# Altium project MCU_BMA_V1_0.PrjPcb
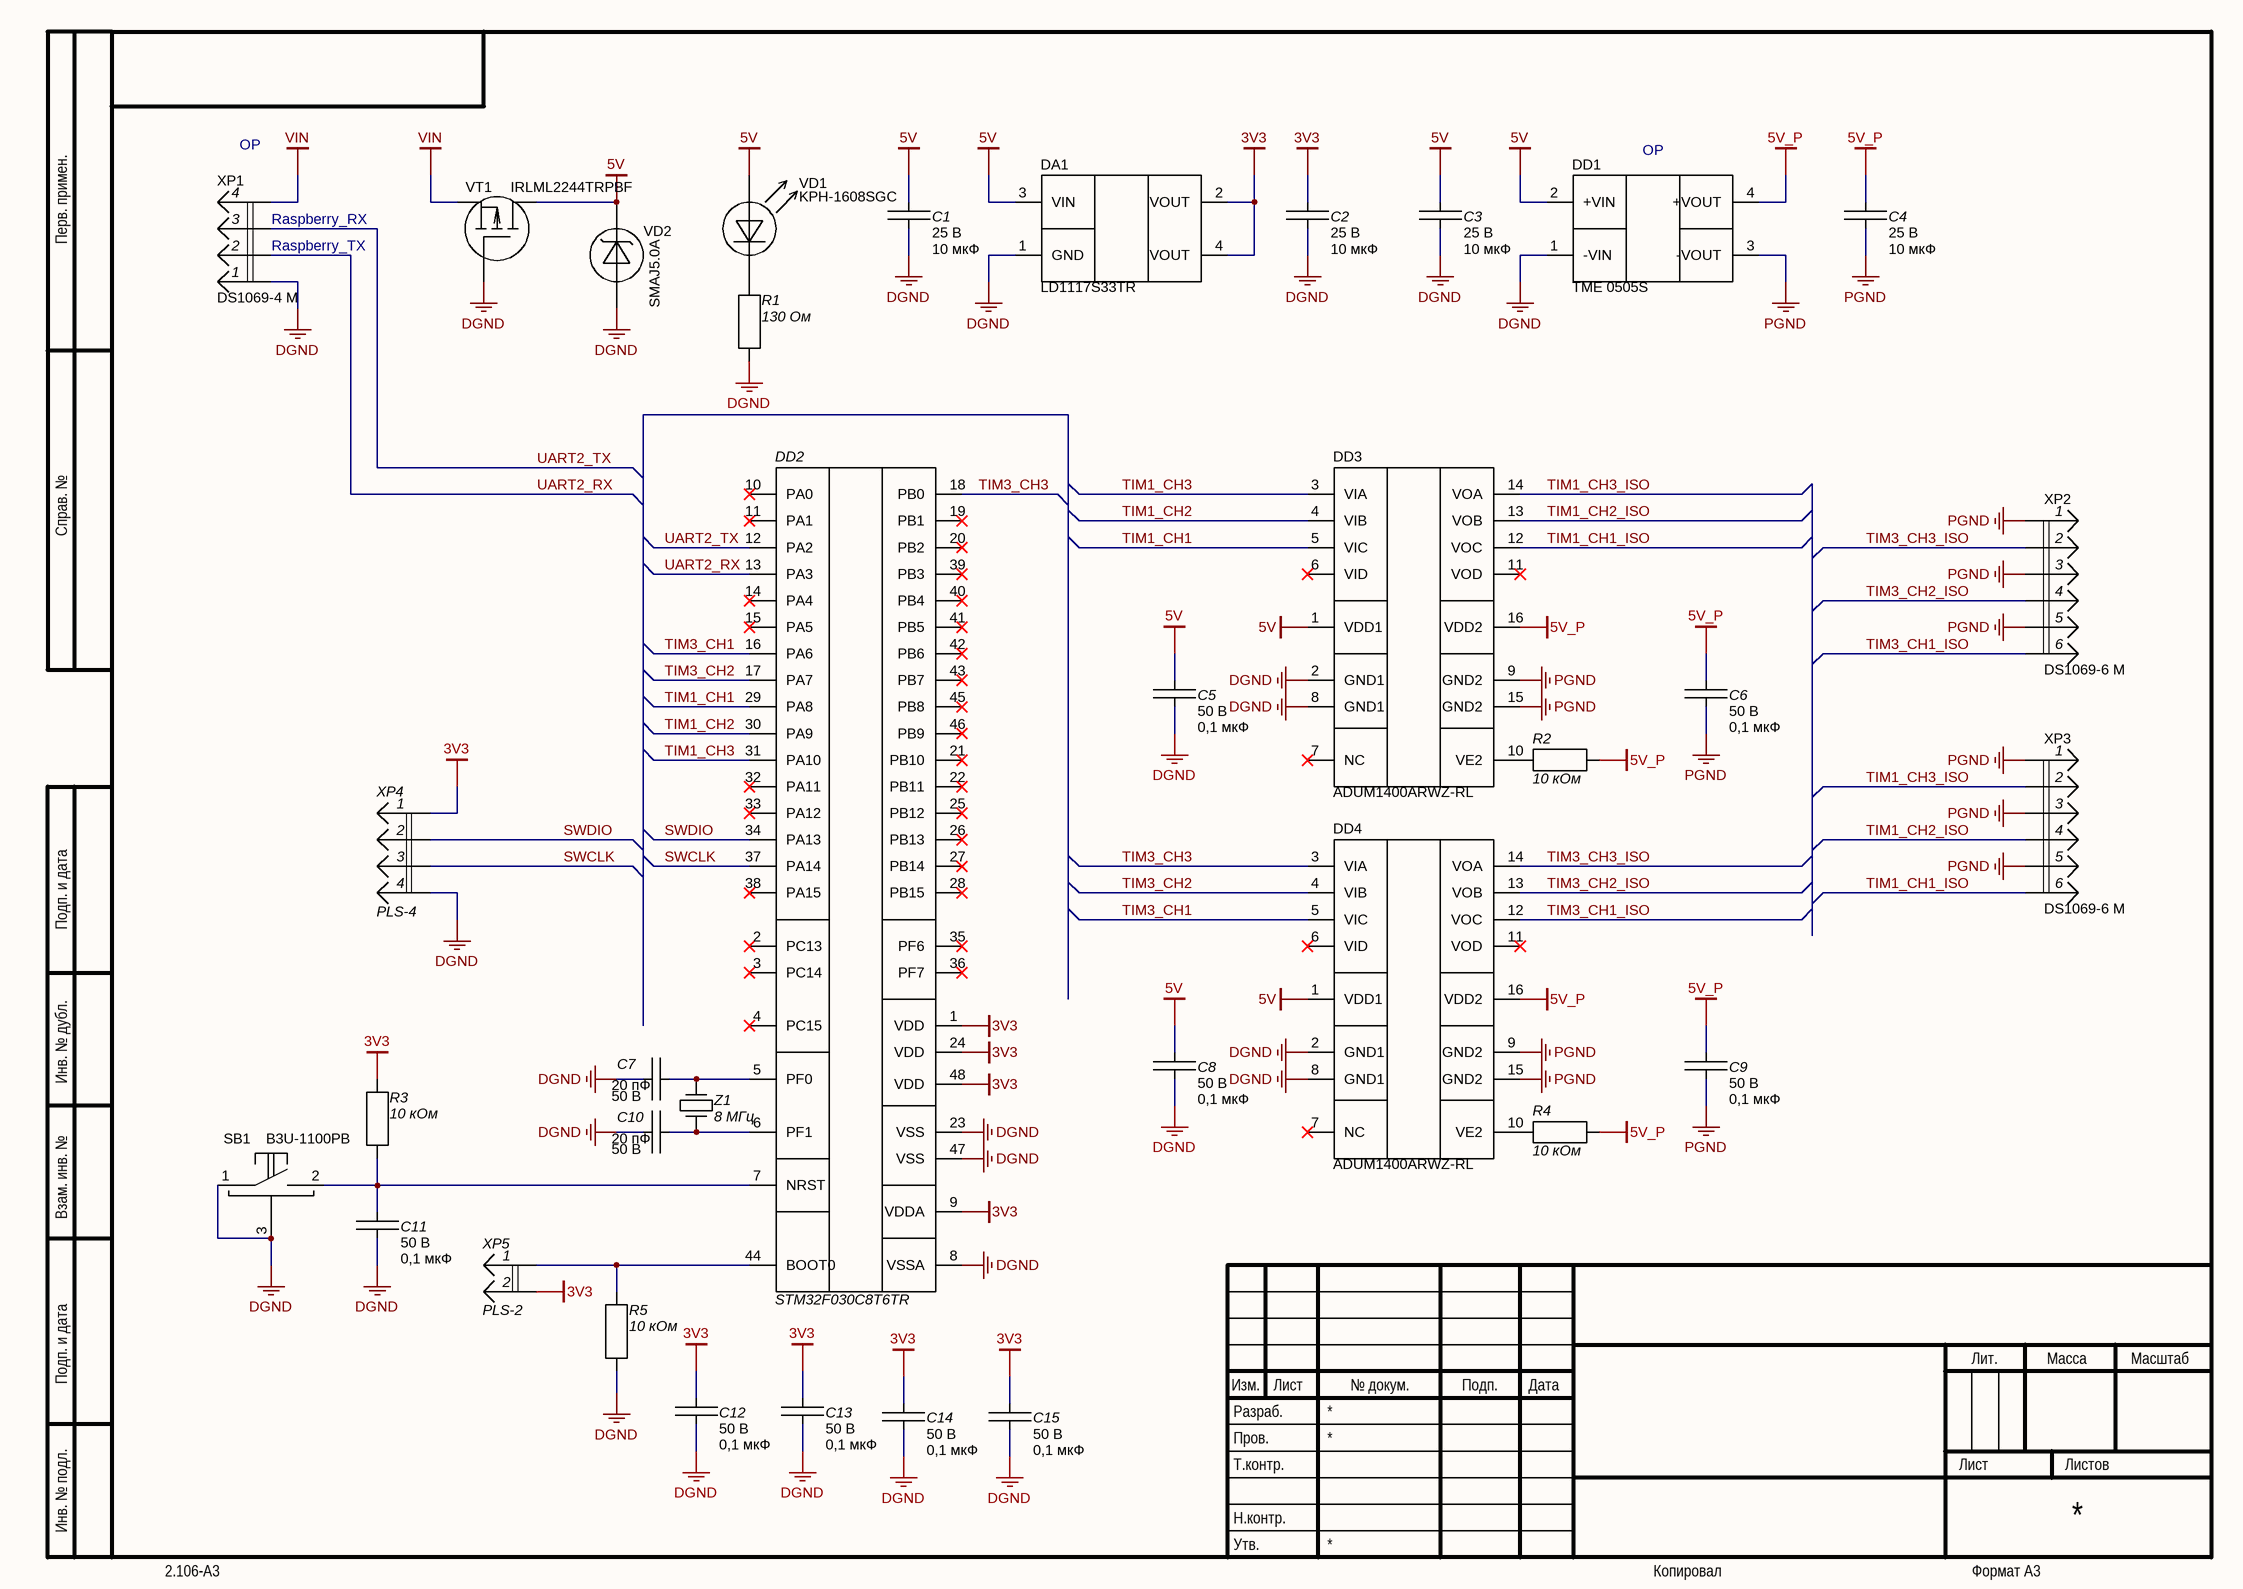
[diagram p0: main.SchDoc]
1 sheet, 35 parts. Net scope: global (net labels, ports and power ports of the same name join across sheets).
Board file: MCU_BMA_V1_0.PcbDoc

## Sheet main.SchDoc
size 420 x 297 mm; Organization: Altium Limited; Address1: L3, 12a Rodborough Rd; Address2: Frenchs Forest; Address3: NSW; Address4: Australia 2086

### Parts
C1  Voltage: 25 В  [C1206C]  (hidden comment: 10 мкФ)
C2  Voltage: 25 В  [C1206C]  (hidden comment: 10 мкФ)
C3  Voltage: 25 В  [C1206C]  (hidden comment: 10 мкФ)
C4  Voltage: 25 В  [C1206C]  (hidden comment: 10 мкФ)
C5  Voltage: 50 В  [C0603C]  (hidden comment: 0,1 мкФ)
C6  Voltage: 50 В  [C0603C]  (hidden comment: 0,1 мкФ)
C7  Voltage: 50 В  [C0603C]  (hidden comment: 20 пФ)
C8  Voltage: 50 В  [C0603C]  (hidden comment: 0,1 мкФ)
C9  Voltage: 50 В  [C0603C]  (hidden comment: 0,1 мкФ)
C10  Voltage: 50 В  [C0603C]  (hidden comment: 20 пФ)
C11  Voltage: 50 В  [C0603C]  (hidden comment: 0,1 мкФ)
C12  Voltage: 50 В  [C0603C]  (hidden comment: 0,1 мкФ)
C13  Voltage: 50 В  [C0603C]  (hidden comment: 0,1 мкФ)
C14  Voltage: 50 В  [C0603C]  (hidden comment: 0,1 мкФ)
C15  Voltage: 50 В  [C0603C]  (hidden comment: 0,1 мкФ)
DA1  LD1117S33TR  [SOT-223]
DD1  TME 0505S  [TME-1W-SINGLE]
DD2  STM32F030C8T6TR  [LQFP48]
DD3  ADUM1400ARWZ-RL  [SOIC-Wide-16]
DD4  ADUM1400ARWZ-RL  [SOIC-Wide-16]
R1  130 Ом  [C0603R]
R2  10 кОм  [C0603R]
R3  10 кОм  [C0603R]
R4  10 кОм  [C0603R]
R5  10 кОм  [C0603R]
SB1  B3U-1100PB  [B3U-1100P]
VD1  KPH-1608SGC  [LED_0603]
VD2  SMAJ5.0A  [DO-214AC]
VT1  IRLML2244TRPBF  [SOT23-3]
XP1  DS1069-4 M  [DS1069-4 M]
XP2  DS1069-6 M  [DS1069-6 M]
XP3  DS1069-6 M  [DS1069-6 M]
XP4  PLS-4  [PLS-4]
XP5  PLS-2  [PLS-2]
Z1  8 МГц  [HC-49SM]

### Nets
3V3: C2.1 C12.1 C13.1 C14.1 C15.1 DA1.2(VOUT) DA1.4(VOUT) DD2.1(VDD) DD2.9(VDDA) DD2.24(VDD) DD2.48(VDD) R3.1 XP4.1 XP5.2
5V: C1.1 C3.1 C5.1 C8.1 DA1.3(VIN) DD1.2(+VIN) DD3.1(VDD1) DD4.1(VDD1) VD1.2 VD2.1(C) VT1.3(D)
5V_P: C4.1 C6.1 C9.1 DD1.4(+VOUT) DD3.16(VDD2) DD4.16(VDD2) R2.2 R4.2
DGND: C1.2 C2.2 C3.2 C5.2 C7.1 C8.2 C10.1 C11.2 C12.2 C13.2 C14.2 C15.2 DA1.1(GND) DD1.1(-VIN) DD2.8(VSSA) DD2.23(VSS) DD2.47(VSS) DD3.2(GND1) DD3.8(GND1) DD4.2(GND1) DD4.8(GND1) R1.2 R5.1 SB1.1 SB1.3 VD2.2(A) VT1.1(G) XP1.1 XP4.4
PGND: C4.2 C6.2 C9.2 DD1.3(-VOUT) DD3.9(GND2) DD3.15(GND2) DD4.9(GND2) DD4.15(GND2) XP2.1 XP2.3 XP2.5 XP3.1 XP3.3 XP3.5
VIN: VT1.2(S) XP1.4
SWCLK: DD2.37(PA14) XP4.3
SWDIO: DD2.34(PA13) XP4.2
TIM1_CH1: DD2.29(PA8) DD3.5(VIC)
TIM1_CH1_ISO: DD3.12(VOC) XP3.6
TIM1_CH2: DD2.30(PA9) DD3.4(VIB)
TIM1_CH2_ISO: DD3.13(VOB) XP3.4
TIM1_CH3: DD2.31(PA10) DD3.3(VIA)
TIM1_CH3_ISO: DD3.14(VOA) XP3.2
TIM3_CH1: DD2.16(PA6) DD4.5(VIC)
TIM3_CH1_ISO: DD4.12(VOC) XP2.6
TIM3_CH2: DD2.17(PA7) DD4.4(VIB)
TIM3_CH2_ISO: DD4.13(VOB) XP2.4
TIM3_CH3: DD2.18(PB0) DD4.3(VIA)
TIM3_CH3_ISO: DD4.14(VOA) XP2.2
UART2_RX: DD2.13(PA3) XP1.2
UART2_TX: DD2.12(PA2) XP1.3
NetC7_2: C7.2 DD2.5(PF0) Z1.2(OSC2)
NetC10_2: C10.2 DD2.6(PF1) Z1.1(OSC1)
NetC11_1: C11.1 DD2.7(NRST) R3.2 SB1.2
NetDD2_44: DD2.44(BOOT0) R5.2 XP5.1
NetDD3_10: DD3.10(VE2) R2.1
NetDD4_10: DD4.10(VE2) R4.1
NetR1_1: R1.1 VD1.1

Not connected (* = marked no-connect by the designer): DD2 2(PC13)* 3(PC14)* 4(PC15)* 10(PA0)* 11(PA1)* 14(PA4)* 15(PA5)* 19(PB1)* 20(PB2)* 21(PB10)* 22(PB11)* 25(PB12)* 26(PB13)* 27(PB14)* 28(PB15)* 32(PA11)* 33(PA12)* 35(PF6)* 36(PF7)* 38(PA15)* 39(PB3)* 40(PB4)* 41(PB5)* 42(PB6)* 43(PB7)* 45(PB8)* 46(PB9)*; DD3 6(VID)* 7(NC)* 11(VOD)*; DD4 6(VID)* 7(NC)* 11(VOD)*

### Notes on the sheet
- (near XP1) OP
- (near DD1) OP
- (near XP1) Raspberry_TX
- (near XP1) Raspberry_RX
- Перв. примен.
- Справ. №
- Подп. и дата
- Инв. № дубл.
- Взам. инв. №
- Разраб.
- Изм.
- Лист
- № докум.
- Подп.
- Дата
- Лит.
- Масса
- Масштаб
- Пров.
- Т.контр.
- Листов
- Инв. № подл.
- Утв.
- Н.контр.
- 2.106-A3
- Копировал
- Формат А3

### Library data of the parts
C1-C4 = CC1206KKX7R8BB106: SMD 1206; X7R; 10 мкФ; 25 В; Manufacturer: YAGEO; Persent: ±15%; Type: Ceramic; Part Number: CC1206KKX7R8BB106; Package: SMD 1206; Dielectric: X7R; ComponentLink1Description: Datasheet; Value: 10 мкФ
C5 C6 C8 C9 C11-C15 = CC0603KRX7R9BB104: SMD 0603 ; X7R; 0,1 мкФ; 50 В; Manufacturer: YAGEO; Persent: ±5%; Type: Ceramic; Part Number: CC0603KRX7R9BB104; Package: SMD 0603; Dielectric: X7R; ComponentLink1Description: Datasheet; Value: 0,1 мкФ
C7 C10 = CC0603JRNPO9BN200: SMD 0603 ; C0G(NP0); 20 пФ; 50 В; Manufacturer: YAGEO; Persent: ±15%; Type: Ceramic; Part Number: CC0603JRNPO9BN200; Package: SMD 0603; Dielectric: C0G(NP0); ComponentLink1Description: Datasheet; Value: 20 пФ
DA1 = LD1117S33TR: Linear regulator, 3V3; Manufacturer: STMicroelectronics; Part Number: LD1117S33TR; Type: Linear regulator
DD1 = TME 0505S: Switching regulator, 5V; Manufacturer: Traco Power; Part Number: TME 0505S; Type: ISO DC/DC
DD2 = STM32F030C8T6TR: Manufacturer: STMicroelectronics; Part Number: STM32F030C8T6TR; Type: MCU
DD3 DD4 = ADUM1400ARWZ-RL: ISO; Manufacturer: Analog Devices; Part Number: ADUM1400ARWZ-RL; Type: ISO
R1 = RC0603FR-07130RL: SMD 0603; 0,1; 1%; 130 Ом; Manufacturer: Yageo; Power: 0,1; Part Number: RC0603FR-07130RL; Package: SMD 0603; Persent: 1%; Value: 130 Ом; Category: R
R2-R5 = RC0603FR-0710KL: SMD 0603; 0,1; 1%; 10 кОм; Manufacturer: Yageo; Power: 0,1; Part Number: RC0603FR-0710KL; Package: SMD 0603; Persent: 1%; Value: 10 кОм; Category: R
SB1 = B3U-1100PB: SB; Manufacturer: OMRON; Part Number: B3U-1100PB; Type: SB
VD1 = KPH-1608SGC: 0603 LED GREEN 10 ucd; Manufacturer: Kingbright; Part Number: KPH-1608SGC; Type: LED
VD2 = SMAJ5.0A: TVS 5 В; Manufacturer: BOURNS; Voltage: 5V; Power: 400W; Part Number: SMAJ5.0A; Type: TVS
VT1 = IRLML2244TRPBF: P MOSFET; Manufacturer: Infineon; Part Number: IRLML2244TRPBF; Type: MOSFET; Сharacter: P
XP1 = DS1069-4 M: Manufacturer: Connfly; Part Number: DS1069-4 M
XP2 XP3 = DS1069-6 M: Manufacturer: Connfly; Part Number: DS1069-6 M
Z1 = 8.000MHzHC-49SM: Part Number: 8.000MHzHC-49SM; Value: 8 МГц; ComponentLink1Description: Datasheet; Manufacturer: -; Type: Quartz
XP4 = PLS-4: Part Number: PLS-4; Type: PLS; ComponentLink1Description: Datasheet; Manufacturer: -
XP5 = PLS-2: Part Number: PLS-2; Type: PLS; ComponentLink1Description: Datasheet; Manufacturer: -